# EasyEDA schematic Efis_Korry.json
TITLE: Sheet_1; REV: 1.0; Date: 2023-09-21; Sheet: 1/1; Drawn By: gagagu1; Company: Your Company
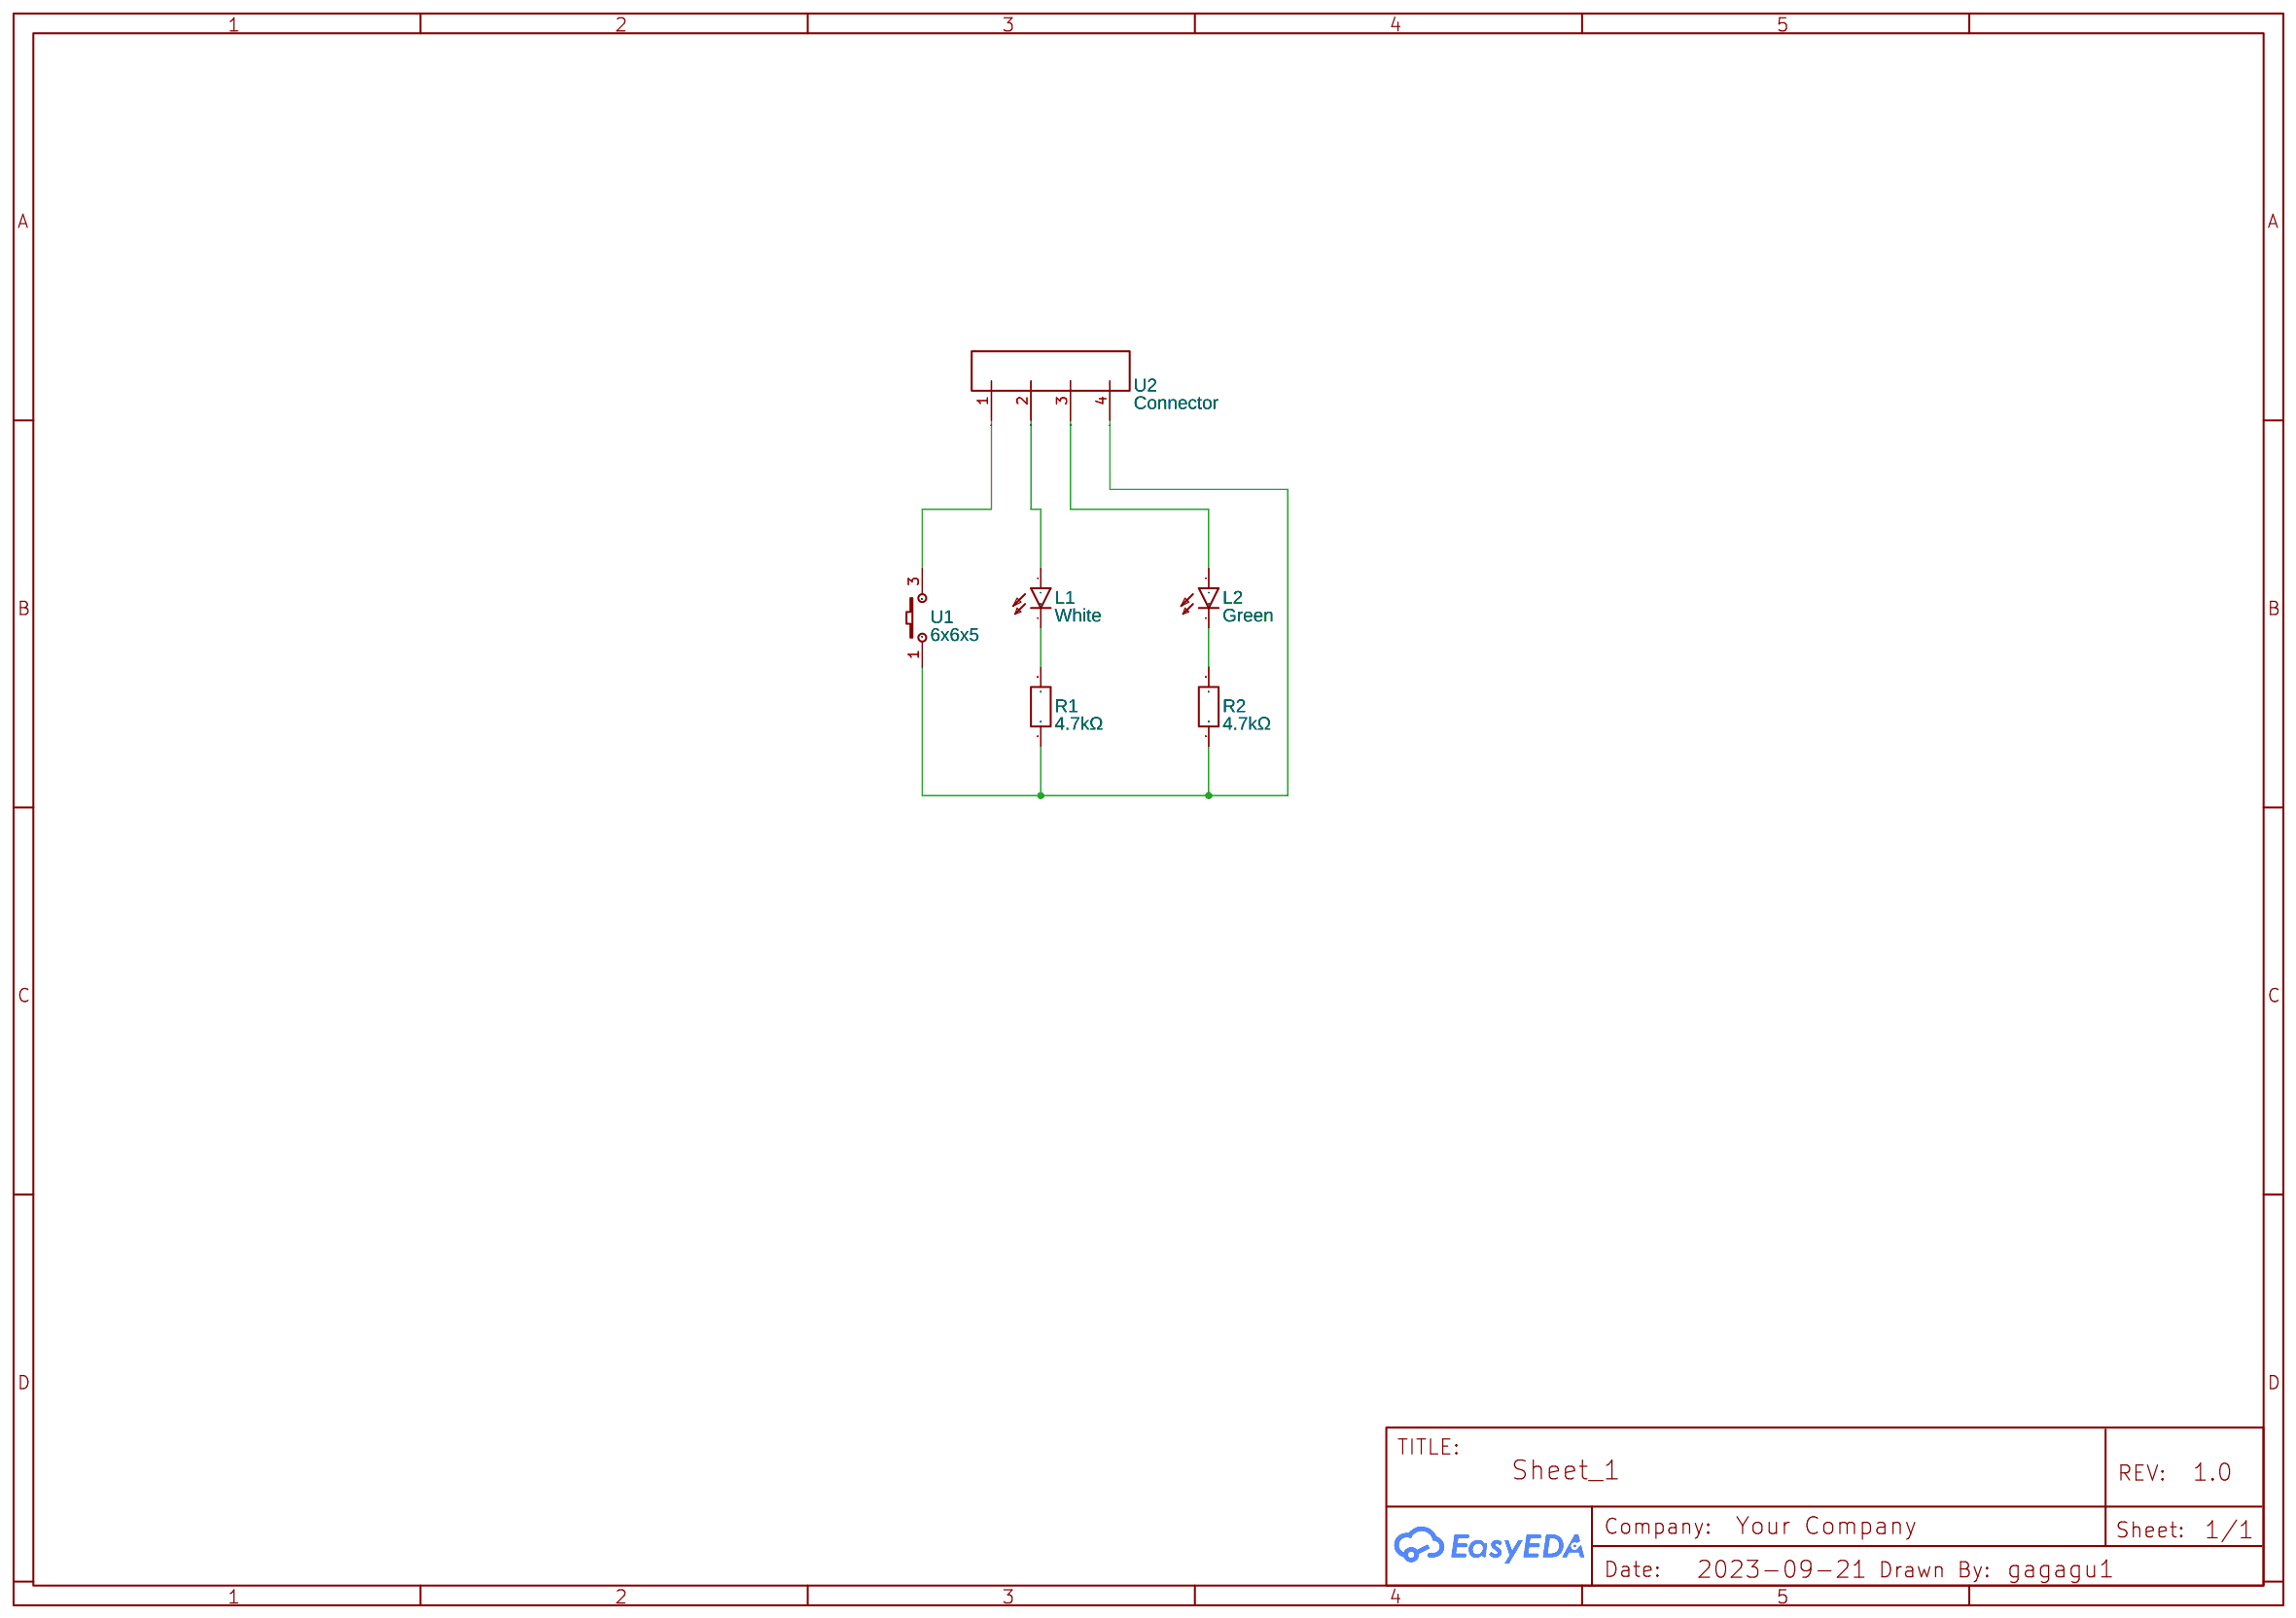
[diagram p0: schematic sheet]

## Parts
L1  White  [LED_LED3MM]
L2  Green  [LED_LED3MM]
R1  4.7kΩ  [R0603]
R2  4.7kΩ  [R0603]
U1  6x6x5  [TLAČITKO 6*6*5]
U2  Connector  [4PINMALECONNECTOR]

## Library data of the parts
L1 L2 = LED3MM: Contributor: mjcooky08
R1 R2 = FRC0603F4701TS: Contributor: LCSC; Supplier: LCSC; Supplier Part: C2907034; Manufacturer: FOJAN(富捷); JLCPCB Part Class: Extended Part; link: https://lcsc.com/eda_search?q=C2907034&%26type=1&ref=editor
U1 = tlačítko 6*6*5: Contributor: michalt690
U2 = 4pinMaleConnector-kafi: Contributor: kafikangi.m

## Nets
Net-(L1-A): L1.A U2.2
Net-(L1-K): L1.K(C) R1.2
Net-(L2-A): L2.A U2.3
Net-(L2-K): L2.K(C) R2.2
Net-(R1-1): R1.1 R2.1 U1.1 U2.4
Net-(U1-3): U1.3 U2.1
